# Altium project HA_MSS200529.PrjPcb
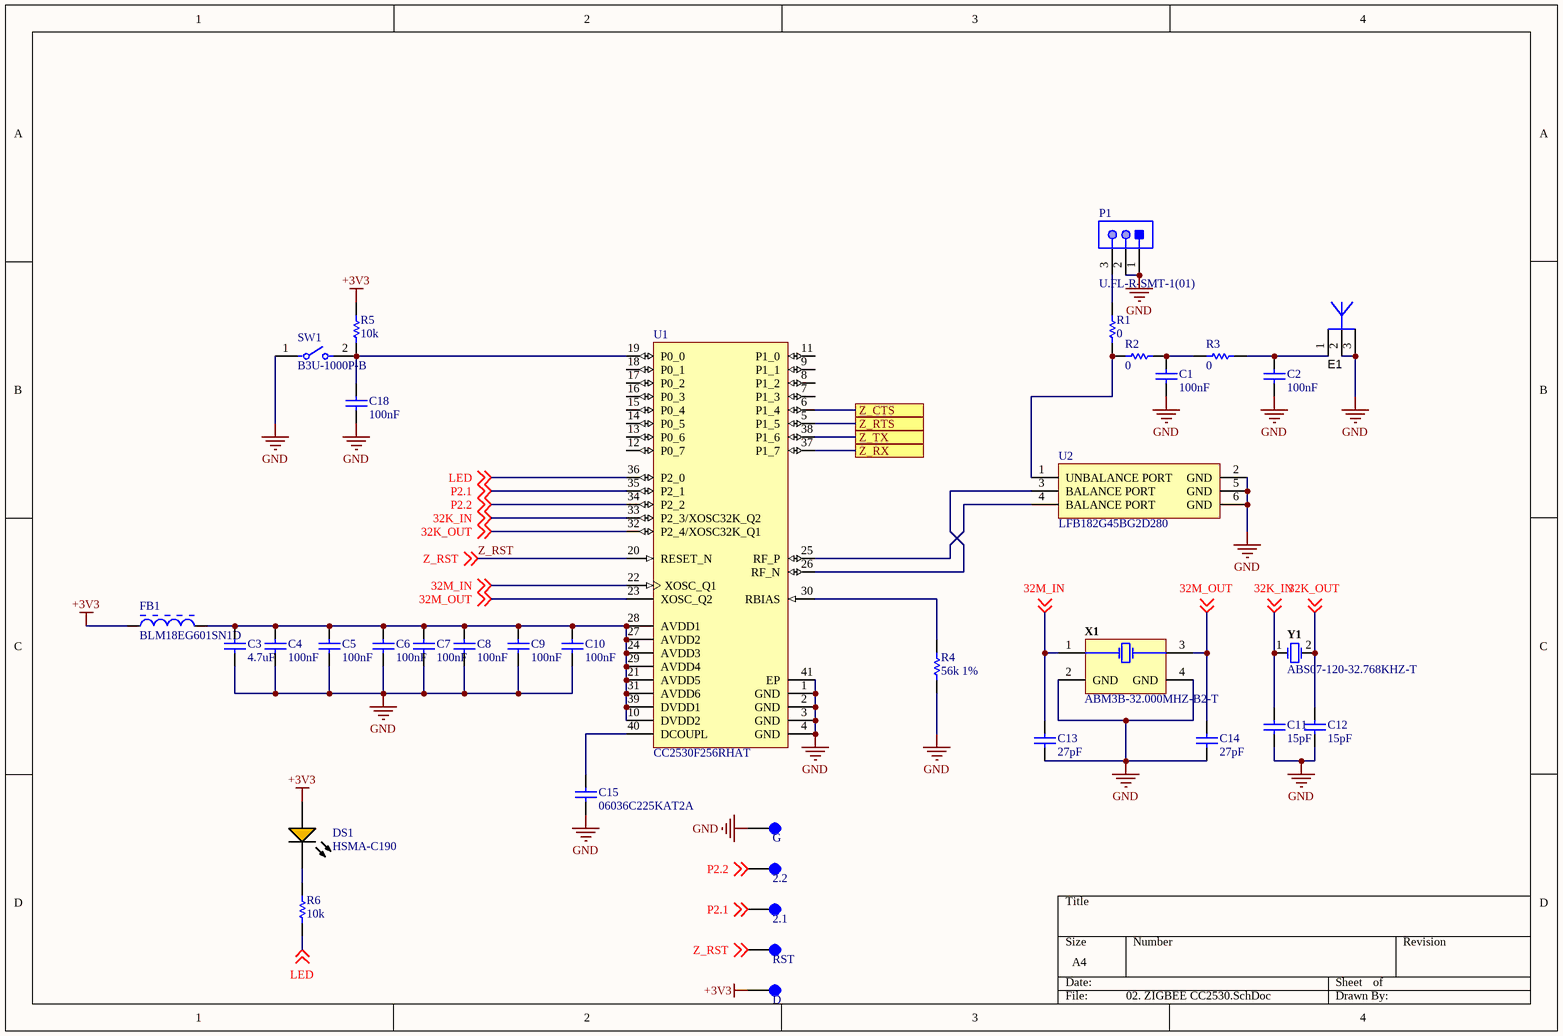
[diagram p0: 02. ZIGBEE CC2530.SchDoc]
4 sheets, 81 parts. Net scope: flat (ports and power ports of the same name join across sheets).
Board file: HA_MSS200529PCB.PcbDoc
Sheets:
  01. MAIN.SchDoc
  02. ZIGBEE CC2530.SchDoc
  03. MCU.SchDoc
  04. SENSOR SHT30, PIR, TSL2561.SchDoc

## Sheet 01. MAIN.SchDoc
size A4

### Notes on the sheet
- Title
- Size:
- Date:
- A4
- Number:
- Time:
- Revision:
- Sheet
- of
- N.S.T
- Design by:
- Check by:
- https://github.com/tung080827

## Sheet 02. ZIGBEE CC2530.SchDoc
size A4

### Parts
2.1  Test Point  [TP]  (value not drawn)
2.2  Test Point  [TP]  (value not drawn)
C1  100nF  [CAPC1005X56X25NL10T15]
C2  100nF  [CAPC1005X56X25NL10T15]
C3  4.7uF  [CAPC1608X90X35NL10T15]
C4  100nF  [CAPC1005X56X25NL10T15]
C5  100nF  [CAPC1005X56X25NL10T15]
C6  100nF  [CAPC1005X56X25NL10T15]
C7  100nF  [CAPC1005X56X25NL10T15]
C8  100nF  [CAPC1005X56X25NL10T15]
C9  100nF  [CAPC1005X56X25NL10T15]
C10  100nF  [CAPC1005X56X25NL10T15]
C11  15pF  [CAPC1005X56X25NL10T15]
C12  15pF  [CAPC1005X56X25NL10T15]
C13  27pF  [CAPC1005X56X25NL10T15]
C14  27pF  [CAPC1005X56X25NL10T15]
C15  06036C225KAT2A  [CAPC1608X90X35NL15T15]
C18  100nF  [CAPC1005X56X25NL10T15]
D  Test Point  [TP]  (value not drawn)
DS1  HSMA-C190  [AVAG-HSMX-C190_V]
E1  ANTENNA_DN007A  [2.4Ghz TI ANTENNA_DN007A]  (value not drawn)  (net tie)
FB1  BLM18EG601SN1D  [MURA-BLM18-F-H1-CHIP-2_V]
G  Test Point  [TP]  (value not drawn)
P1  U.FL-R-SMT-1(01)  [HRS-U.FL-R-SMT-3_V]
R1  0  [RESC1005X40X25NL05T05]
R2  0  [RESC1005X40X25NL05T05]
R3  0  [RESC1005X40X25NL05T05]
R4  56k 1%  [RESC1609X50X30NL10T20]
R5  10k  [RESC1005X40X25NL05T05]
R6  10k  [RESC1005X40X25NL05T05]
RST  Test Point  [TP]  (value not drawn)
SW1  B3U-1000P-B  [FP-B3U-1000P-B-MFG]
U1  CC2530F256RHAT  [RHA0040H_V]
U2  LFB182G45BG2D280  [MURA-LFB182G45BG5D920-6_V]
X1  ABM3B-32.000MHZ-B2-T  [ABRA-ABM3B_V]
Y1  ABS07-120-32.768KHZ-T  [ABRA-ABS07_A_V]

### Ports
Z_CTS, Z_RTS, Z_RX, Z_TX

### Nets
+3V3: D.1 DS1.1(A) FB1.1 R5.2
GND: C1.1 C2.1 C3.1 C4.1 C5.1 C6.1 C7.1 C8.1 C9.1 C10.1 C11.2 C12.2 C13.1 C14.1 C15.1 C18.1 E1.2 E1.3 G.1 P1.1 P1.2 R4.1 SW1.1 U1.1(GND) U1.2(GND) U1.3(GND) U1.4(GND) U1.41(EP) U2.2(GND) U2.5(GND) U2.6(GND) X1.2(GND) X1.4(GND)
32K_IN: C11.1 U1.33(P2_3/XOSC32K_Q2) Y1.1 ; off-sheet 32K_IN
32K_OUT: C12.1 U1.32(P2_4/XOSC32K_Q1) Y1.2 ; off-sheet 32K_OUT
32M_IN: C13.2 U1.22(XOSC_Q1) X1.1(X1) ; off-sheet 32M_IN
32M_OUT: C14.2 U1.23(XOSC_Q2) X1.3(X2) ; off-sheet 32M_OUT
LED: R6.1 U1.36(P2_0) ; off-sheet LED
P2.1: 2.1.1 U1.35(P2_1) ; off-sheet P2.1
P2.2: 2.2.1 U1.34(P2_2) ; off-sheet P2.2
Z_RST: RST.1 U1.20(RESET_N) ; off-sheet Z_RST
NetC1_2: C1.2 R2.1 R3.2
NetC2_2: C2.2 E1.1 R3.1
NetC3_2: C3.2 C4.2 C5.2 C6.2 C7.2 C8.2 C9.2 C10.2 FB1.2 U1.10(DVDD2) U1.21(AVDD5) U1.24(AVDD3) U1.27(AVDD2) U1.28(AVDD1) U1.29(AVDD4) U1.31(AVDD6) U1.39(DVDD1)
NetC15_2: C15.2 U1.40(DCOUPL)
NetC18_2: C18.2 R5.1 SW1.2 U1.19(P0_0)
NetDS1_2: DS1.2(K) R6.2
NetP1_3: P1.3 R1.1
NetR1_2: R1.2 R2.2 U2.1(UNBALANCE_PORT)
NetR4_2: R4.2 U1.30(RBIAS)
NetU1_5: U1.5(P1_5) ; port Z_RTS
NetU1_6: U1.6(P1_4) ; port Z_CTS
NetU1_25: U1.25(RF_P) U2.4(BALANCE_PORT)
NetU1_26: U1.26(RF_N) U2.3(BALANCE_PORT)
NetU1_37: U1.37(P1_7) ; port Z_RX
NetU1_38: U1.38(P1_6) ; port Z_TX

Not connected (* = marked no-connect by the designer): U1 7(P1_3) 8(P1_2) 9(P1_1) 11(P1_0) 12(P0_7) 13(P0_6) 14(P0_5) 15(P0_4) 16(P0_3) 17(P0_2) 18(P0_1)

### Library data of the parts
2.1 2.2 D G RST = TP
C1 C2 C4-C10 C18 = CMP-2008-02743-1: Manufacturer: AVX Interconnect / Elco; Part Number: 04026D104KAT2A
C3 = CMP-2006-02545-1: Part Number: GRM188R6YA475KE15D; Manufacturer: Murata
C11-C14 = CMP-2008-02620-1: Part Number: 04025A270FAT2A; Manufacturer: AVX Interconnect / Elco
C15 = CMP-2006-04473-1: Manufacturer: AVX Interconnect / Elco; Part Number: 06036C225KAT2A
DS1 = CMP-1744-00005-1: LED Uni-Color Amber, 60 mW, 20 mA, -40 to 85 degC, 2-Pin SMD, RoHS, Tape and Reel; Resistance: 70000 Ohm; ESR: 70 kohm; Frequency: 32.768 KHz; Tolerance: 20ppm; Load Capacitance: 12.5 pF; Capacitance: 1.25E-11 f; Length: 0.126 inch; ComponentLink1Description: Manufacturer URL; Min Operating Temperature: -40degC; RoHSCompliant: True; ComponentLink1URL: http://www.avagotech.com/; Packaging: Tape and Reel; PackageDescription: 2-Pin Surface Mount Device, Body 1.6 x 0.8 mm, Height 0.9 mm; ComponentLink3Description: Package Specification; Width: 0.059 inch; Mount: Surface Mount; REACH SVHC: No SVHC; ComponentLink2URL: http://docs.avagotech.com/docs/AV02-0112EN; Height: 0.033 inch; ComponentLink2Description: Datasheet; Pins: 2; Frequency Tolerance: 20ppm; Max Operating Temperature: 85degC; ComponentLink3URL: http://www.fairchildsemi.com/dwg/MA/MA03D.pdf; PackageReference: HSMX-C190; Package Quantity: 1; DatasheetVersion: Sep-10
E1 = ANTENNA_DN007A: 2.4GHz PCB Antenna.  There is nothing to buy or mount.; SymbolCreator: a0412235; SymbolVersion: 2014-08-14; PartNumber: ANTENNA_DN007A; Manufacturer: N/A; CompType: Antenna; MountType: N/A; ComponentLink1Description: Datasheet Link; ComponentLink1URL: https://sps06.itg.ti.com/sites/KMS/crossdivteams/altium/docs/ComponentDatasheets/CC26xxEM-7IB_1_0_Layout.pdf; PackageReference: SMD, 3-Leads; Publisher: Texas Instruments; LatestRevisionDate: 2015-12-09
FB1 = CMP-0686-00354-2: Chip Ferrite Bead for GHz Band General Use (Low DC Resistance Type), 600 Ohm, 500 mA, -55 to 125 degC, 1.6 x 0.8 x 0.95 mm SMD, Tape and Reel; Manufacturer: Murata; Rated Current: 500 mA; DC Resistance: 0.35 Ohm Max.; Impedance (at 100 MHz): 600 Ohm +/- 25%; Packing: Tape and Reel; ComponentLink2URL: http://www.murata.com/products/catalog/pdf/c31e.pdf; PartNumber: BLM18EG601SN1D; Mounting Technology: Surface Mount; Operating Temperature Range: -55 to 125 degC; ComponentLink3URL: http://www.murata.com/products/catalog/pdf/c31e.pdf; ComponentLink2Description: Datasheet; ComponentLink1Description: Manufacturer URL; DatasheetVersion: 08/2013; ComponentLink1URL: http://www.murata.com/; PackageReference: BLM18_H950-2; ComponentLink3Description: Package Specification; PackageDescription: 2-Pin Chip, Body 1.6 x 0.8 mm
P1 = CMP-2000-05153-1: Ultra Small Coaxial Connector, 6 GHz, -40 to 90 degC, 3-Pin SMD, RoHS, Bulk; Manufacturer: Hirose Electric; Connector Style: U.FL; Impedance: 50Ohm; Dielectric Material: LiquidCrystalPolymer(LCP); Minimum Quantity: UltraMiniatureCoaxial; Online Catalog: U.FLSeries; Featured Product: HiroseU.FLSeries; Frequency - Max: 6GHz; Other Names: H122041 / U.FL-R-SMT-1(01)-ND; Contact Termination: Solder; Body Material: PhosphorBronze; Connector Type: Jack,MalePin; Body Finish: Silver; Center Contact Plating: Gold; Manufacturer URL: https://www.hirose.com; Family: CoaxialConnectors(RF); Fastening Type: Snap-On; Unit PriceUSD: U.FL; Series: U.FL; Package Reference: U.FL-R-SMT; Packaging: Bulk; Standard Package: 100; Mounting Type: SurfaceMount; Quantity Available: Bulk; Housing Color: Silver; Package Description: 3-Pin Surface Mount Device, Body 2.6 x 2.6 mm; Category: Connectors,Interconnects; Operating Temperature: -40degC~90degC; Center Contact Material: PhosphorBronze; Dynamic Catalog: U.FLSeries; Datasheet URL: https://datasheet.ciiva.com/26945/getdatasheetpartid-475239-26945414.pdf; Datasheet Version: Feb-09; Shield Termination: Solder
R1-R3 R5 R6 = CMP-2000-07588-1: Chip Resistor, 10 KOhm, +/- 1%, 0.1 W, -55 to 155 degC, 0402 (1005 Metric), RoHS, Tape and Reel; Manufacturer: Panasonic; Power Rating: 100mW; Voltage Rating: 50V; Resistance: 10KOhm; Case\/Package: 0402; Temperature Coefficient: 100ppm\/degreesC; RoHSCompliant: True; Lead Free: LeadFree; Package Quantity: 1; Contact Plating: Tin; Length: 1mm; Radiation Hardening: No; REACH SVHC: NoSVHC; Max Operating Temperature: 155degC; Depth: 0.5mm; Case Code (Imperial): 0402; Military Standard: Not; Package Description: 2-Pin Surface Mount Device, Body 1 x 0.5 mm; Termination: SMD/SMT; Case Code (Metric): 1005; Height: 0.35mm; Packaging: TapeandReel; Voltage Rating (DC): 50V; Package Reference: 402; Number of Pins: 2; Tolerance: 1%; Mounting Technology: SurfaceMount; Width: 0.02inch; Mount: SurfaceMount; Datasheet URL: https://industrial.panasonic.com/cdbs/www-data/pdf/RDA0000/AOA0000C304.pdf; Composition: ThickFilm; Datasheet Version: 02/2017; Manufacturer URL: http://www.panasonic.com/; Max Power Dissipation: 100mW; Number of Terminations: 2; Min Operating Temperature: -55degC
R4 = CMP-2000-03467-1: Part Number: CRCW060356K0FKEA; Manufacturer: Vishay Dale
SW1 = CMP-08834-000005-1: SWITCH TACTILE SPST-NO 0.05A 12V; Manufacturer: Omron; Operating Force: 1.5N; Contact Current Rating: 50mA; Contact Resistance: 100mΩ; Electromechanical Life: 200000Cycles; Height: 1.75mm; Device Class L2: Switches; Temperature Range High: +70°C; Digikey Description: SWITCH TACTILE SPST-NO 0.05A 12V; Throw Configuration: SPST-NO; Ambient Temperature Range High: +70°C; Temperature: -25°C to +70°C; Lead Free: Yes; ComponentLink2URL: https://omronfs.omron.com/en_US/ecb/products/pdf/en-b3u.pdf; Device Class L3: Tactile Switches; Manufacturer Part Number: B3U-1000P-B; Ambient Temperature Range Low: -25°C; Mount: Surface Mount; Automotive: No; Mouser Description: Tactile Switches Top Actuated with boss w/o ground; Octopart: https://octopart.com/b3u-1000p-b-omron-1057356; RoHS: TRUE; Package: 0; Device Class L1: Electromechanical; Voltage Rating Dc: 12V; Category: Switch; Temperature Range Low: -25°C; ComponentLink2Description: Datasheet
U1 = CMP-0458-00002-3: CC2530 System-on-Chip Solution for 2.4-GHz IEEE 802.15.4 and ZigBee Applications; Manufacturer: Texas Instruments; Frequency Range: 2.4GHz; Data Rate (Max) (kbps): 250; Pin/Package: 40VQFN; Modulation Techniques: DSSS; Standby Current (uA): 0.4; Antenna Connection: Differential; Flash size (KB): 256; Operating Voltage (Min) (V): 2; RAM Size (KB): 8; Sensitivity (Best) (dBm): -97; RX Current (Lowest) (mA): 20.5; TX Power (dBm): 4.5; Operating Voltage (Max) (V): 3.6; Wakeup Time (PD-->RX/TX) (us): 600; ComponentLink3URL: http://www.ti.com/lit/ml/mpqf135c/mpqf135c.pdf; ComponentLink1URL: http://www.ti.com/; Device Type: System-on-Chip; ComponentLink2URL: http://www.ti.com/lit/ds/symlink/cc2530.pdf; ComponentLink2Description: Datasheet; ComponentLink1Description: Manufacturer URL; Mounting Technology: Surface Mount; PartNumber: CC2530F256RHAT; DatasheetVersion: SWRS081B; ComponentLink3Description: Package Specification; PackageVersion: 4204276/E; PackageDescription: 40-Pin Quad Flat No-Lead Package, Body 6 x 6mm, Pitch 0.5mm; PackageReference: RHA0040H
U2 = CMP-2000-06539-1: Balance Matching Band Pass Filter, -40 to 85 degC, 6-Pin SMD, RoHS, Tape and Reel; Manufacturer: Murata; Insertion Loss: 0.75dB; Bandwidth: 2.45GHz; Frequency Range: 2.4GHzto2.5GHz; Impedance: 50Ohms; Brand: MurataElectronics; Frequency: 2.4GHz; Product: BandPassFilters; Mounting Technology: SurfaceMount; Product Category: SignalConditioning; RoHS: Details; Packaging: Reel; Operating Temperature Range: -40Cto+85C; Series: LFB; Package Reference: LFB182G45BG2D280; Datasheet Version: 01/2016; Package / Case: 0603(1608metric); Manufacturer URL: http://www.murata.com/; PartNumber: LFB182G45BG2D280; Datasheet URL: http://www.murata.com/~/media/webrenewal/products/balun/balun/forconnectivity/lfb182g45bg2d280.ashx?la=en; Factory Pack Quantity: 4000; Package Description: 6-Pin Chip Array, Body 1.6 x 0.8 mm, Pitch 0.5 mm; Type: BandPassFilter; Termination Style: SMD/SMT
X1 = CMP-1688-00002-1: Ceramic SMD Crystal, 8 MHz, +/- 20 ppm, 200 Ohm, -20 to 70 degC, 4-Pin SMD, RoHS, Tape and Reel; Max Supply Voltage: 45 V; Outputs: 4; Min Supply Voltage: 8.2 V; Output Voltage: 3.3 V; Switching Frequency: 30 KHz; Output Current: 1.8 A; Packaging: Rail/Tube; ComponentLink2Description: Datasheet; REACH SVHC: No SVHC; ComponentLink1URL: http://www.abracon.com/; PackageReference: ABM3B; Weight: 0.004233 oz; Height: 1.05 mm; ComponentLink2URL: http://www.abracon.com/Resonators/abm3b.pdf; Mount: Surface Mount; Min Operating Temperature: -40 degC; Max Operating Temperature: 85 degC; Package Quantity: 50; PackageDescription: 4-Pin Surface Mount Device, Body 5 x 3.2 mm; Pins: 28; DatasheetVersion: Aug-15; ComponentLink1Description: Manufacturer URL; RoHSCompliant: true; Radiation Hardening: No; Length: 9.8 mm; Width: 4.5 mm
Y1 = CMP-2000-07587-1: Tuning Fork Crystal, 32.768 KHz, +/- 20 ppm, -40 to 85 degC, 2-Pin SMD, RoHS, Tape and Reel; Manufacturer: Abracon; Case\/Package: SMD/SMT; Series Resistance: 60KOhm; Frequency Tolerance: 20ppm; Load Capacitance: 6pF; ESR (Equivalent Series Resistance): 55KOhm; Max Operating Temperature: 85degC; Width: 0.061inch; Radiation Hardening: No; Lead Free: LeadFree; RoHSCompliant: True; Depth: 1.5mm; Datasheet URL: http://www.abracon.com/Resonators/ABS07-120-32.768kHz-T.pdf; Frequency: 32.768KHz; Termination: SMD/SMT; Manufacturer URL: http://www.abracon.com/; Package Quantity: 3000; Packaging: TapeandReel; Number of Pins: 2; Height: 0.035inch; Package Description: 2-Pin Surface Mount Device, Body 3.2 x 1.5 mm; Package Reference: ABS07; Mount: SurfaceMount; Tolerance: 20ppm; Mounting Technology: SurfaceMount; REACH SVHC: NoSVHC; Datasheet Version: 11/2014; Length: 3.2mm; Min Operating Temperature: -40degC

## Sheet 03. MCU.SchDoc
size A4
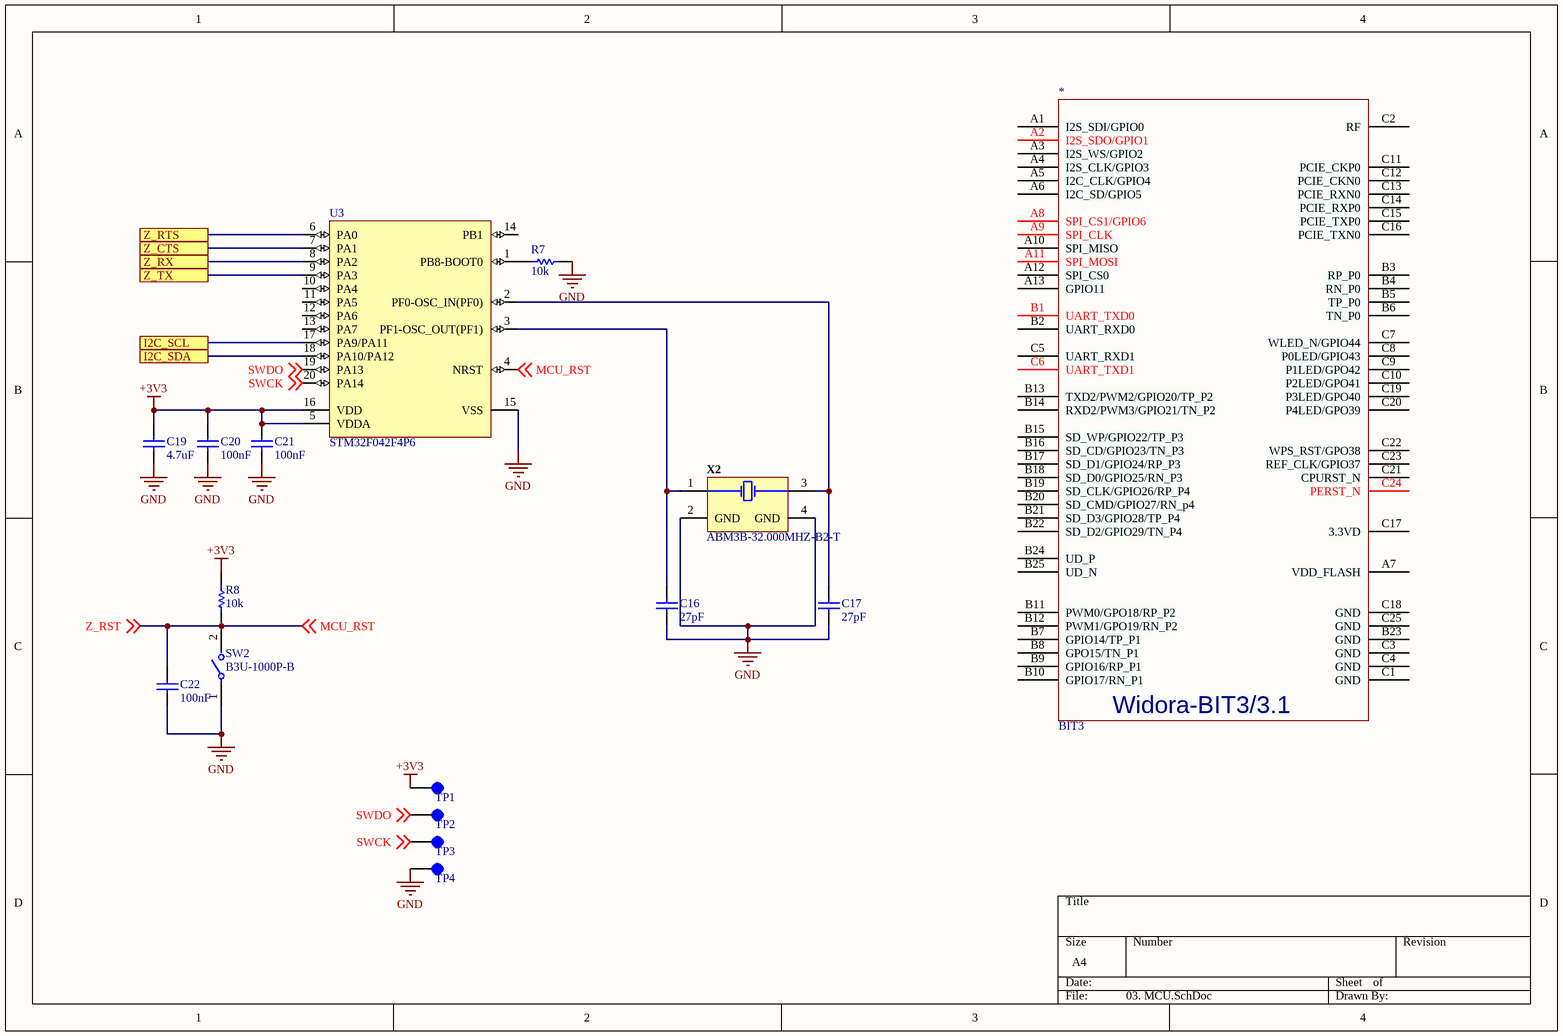
[diagram p1: 03. MCU.SchDoc]

### Parts
*  BIT3  [Widora-BIT3]
C16  27pF  [CAPC1005X56X25NL10T15]
C17  27pF  [CAPC1005X56X25NL10T15]
C19  4.7uF  [CAPC1608X90X35NL10T15]
C20  100nF  [CAPC1005X56X25NL10T15]
C21  100nF  [CAPC1005X56X25NL10T15]
C22  100nF  [CAPC1005X56X25NL10T15]
R7  10k  [RESC1005X40X25NL05T05]
R8  10k  [RESC1005X40X25NL05T05]
SW2  B3U-1000P-B  [FP-B3U-1000P-B-MFG]
TP1  Test Point  [TP]  (value not drawn)
TP2  Test Point  [TP]  (value not drawn)
TP3  Test Point  [TP]  (value not drawn)
TP4  Test Point  [TP]  (value not drawn)
U3  STM32F042F4P6  [STM-TSSOP20_M]
X2  ABM3B-32.000MHZ-B2-T  [ABRA-ABM3B_V]

### Ports
I2C_SCL, I2C_SDA, Z_CTS, Z_RTS, Z_RX, Z_TX

### Nets
+3V3: C19.2 C20.2 C21.2 R8.1 TP1.1 U3.5(VDDA) U3.16(VDD)
GND: C16.1 C17.1 C19.1 C20.1 C21.1 C22.1 R7.1 SW2.1 TP4.1 U3.15(VSS) X2.2(GND) X2.4(GND)
SWCK: TP3.1 U3.20(PA14) ; off-sheet SWCK
SWDO: TP2.1 U3.19(PA13) ; off-sheet SWDO
Z_RST: C22.2 R8.2 SW2.2 U3.4(NRST) ; off-sheet MCU_RST, off-sheet Z_RST  [also labelled MCU_RST]
NetC16_2: C16.2 U3.3(PF1-OSC_OUT(PF1)) X2.1(X1)
NetC17_2: C17.2 U3.2(PF0-OSC_IN(PF0)) X2.3(X2)
NetR7_2: R7.2 U3.1(PB8-BOOT0)
NetR9_1: U3.18(PA10/PA12) ; port I2C_SDA
NetR10_1: U3.17(PA9/PA11) ; port I2C_SCL
NetU1_5: U3.6(PA0) ; port Z_RTS
NetU1_6: U3.7(PA1) ; port Z_CTS
NetU1_37: U3.8(PA2) ; port Z_RX
NetU1_38: U3.9(PA3) ; port Z_TX

Not connected (* = marked no-connect by the designer): * A1(I2S_SDI/GPIO0) A2(I2S_SDO/GPIO1) A3(I2S_WS/GPIO2) A4(I2S_CLK/GPIO3) A5(I2C_CLK/GPIO4) A6(I2C_SD/GPIO5) A7(VDD_FLASH) A8(SPI_CS1/GPIO6) A9(SPI_CLK) A10(SPI_MISO) A11(SPI_MOSI) A12(SPI_CS0) A13(GPIO11) B1(UART_TXD0) B2(UART_RXD0) B3(RP_P0) B4(RN_P0) B5(TP_P0) B6(TN_P0) B7(GPIO14/TP_P1) B8(GPO15/TN_P1) B9(GPIO16/RP_P1) B10(GPIO17/RN_P1) B11(PWM0/GPO18/RP_P2) B12(PWM1/GPO19/RN_P2) B13(TXD2/PWM2/GPIO20/TP_P2) B14(RXD2/PWM3/GPIO21/TN_P2) B15(SD_WP/GPIO22/TP_P3) B16(SD_CD/GPIO23/TN_P3) B17(SD_D1/GPIO24/RP_P3) B18(SD_D0/GPIO25/RN_P3) B19(SD_CLK/GPIO26/RP_P4) B20(SD_CMD/GPIO27/RN_p4) B21(SD_D3/GPIO28/TP_P4) B22(SD_D2/GPIO29/TN_P4) B23(GND) B24(UD_P) B25(UD_N) C1(GND) C2(RF) C3(GND) C4(GND) C5(UART_RXD1) C6(UART_TXD1) C7(WLED_N/GPIO44) C8(P0LED/GPIO43) C9(P1LED/GPO42) C10(P2LED/GPO41) C11(PCIE_CKP0) C12(PCIE_CKN0) C13(PCIE_RXN0) C14(PCIE_RXP0) C15(PCIE_TXP0) C16(PCIE_TXN0) C17(3.3VD) C18(GND) C19(P3LED/GPO40) C20(P4LED/GPO39) C21(CPURST_N) C22(WPS_RST/GPO38) C23(REF_CLK/GPIO37) C24(PERST_N) C25(GND); U3 10(PA4) 11(PA5) 12(PA6) 13(PA7) 14(PB1)

### Notes on the sheet
- (in symbol BIT3) Widora-BIT3/3.1

### Library data of the parts
C16 C17 = CMP-2008-02620-1: as C11 on sheet 02. ZIGBEE CC2530
C19 = CMP-2006-02545-1: as C3 on sheet 02. ZIGBEE CC2530
C20-C22 = CMP-2008-02743-1: as C1 on sheet 02. ZIGBEE CC2530
R7 R8 = CMP-2000-07588-1: as R1 on sheet 02. ZIGBEE CC2530; RoHSCompliant: True; Lead Free: LeadFree; Package Quantity: 1; Contact Plating: Tin; Length: 1mm; Radiation Hardening: No; REACH SVHC: NoSVHC; Max Operating Temperature: 155degC; Depth: 0.5mm; Case Code (Imperial): 0402; Military Standard: Not; Package Description: 2-Pin Surface Mount Device, Body 1 x 0.5 mm; Termination: SMD/SMT; Case Code (Metric): 1005; Height: 0.35mm; Packaging: TapeandReel; Voltage Rating (DC): 50V; Package Reference: 402; Number of Pins: 2; Tolerance: 1%; Mounting Technology: SurfaceMount; Width: 0.02inch; Mount: SurfaceMount; Datasheet URL: https://industrial.panasonic.com/cdbs/www-data/pdf/RDA0000/AOA0000C304.pdf; Composition: ThickFilm; Datasheet Version: 02/2017; Manufacturer URL: http://www.panasonic.com/; Max Power Dissipation: 100mW; Number of Terminations: 2; Min Operating Temperature: -55degC
SW2 = CMP-08834-000005-1: as SW1 on sheet 02. ZIGBEE CC2530; Height: 1.75mm; Device Class L2: Switches; Temperature Range High: +70°C; Digikey Description: SWITCH TACTILE SPST-NO 0.05A 12V; Throw Configuration: SPST-NO; Ambient Temperature Range High: +70°C; Temperature: -25°C to +70°C; Lead Free: Yes; ComponentLink2URL: https://omronfs.omron.com/en_US/ecb/products/pdf/en-b3u.pdf; Device Class L3: Tactile Switches; Manufacturer Part Number: B3U-1000P-B; Ambient Temperature Range Low: -25°C; Mount: Surface Mount; Automotive: No; Mouser Description: Tactile Switches Top Actuated with boss w/o ground; Octopart: https://octopart.com/b3u-1000p-b-omron-1057356; RoHS: TRUE; Package: 0; Device Class L1: Electromechanical; Voltage Rating Dc: 12V; Category: Switch; Temperature Range Low: -25°C; ComponentLink2Description: Datasheet
TP1-TP4 = TP
U3 = CMP-0304-00106-2: ARM Cortex-M0 32-bit MCU, 16 KB Flash, 6 KB Internal RAM, 16 I/Os, 20-Pin TSSOP, -40 to 85 degC, Tray; Manufacturer: STMicroelectronics; Supply Voltage(Vcc) min (V): 2; Operating Frequency(F) (Processor speed) (MHz): 48; Internal RAM Size (kB): 6; FLASH Size (Prog) (kB): 16; PartNumber: STM32F042F4P6; DatasheetVersion: Rev. 5; Package Reference: TSSOP20; Packing: Tray; ComponentLink2URL: http://www.st.com/st-web-ui/static/active/en/resource/technical/document/datasheet/DM00105814.pdf; Core: ARM Cortex-M0; ComponentLink2Description: Datasheet; ComponentLink1URL: http://www.st.com/; Package Description: 20-Pin Thin Shrink Small Outline Package, Body 6.5 x 4.4 mm, Pitch 0.65 mm; Mounting Technology: Surface Mount; ComponentLink1Description: Manufacturer URL; I/Os (High Current): 16
X2 = CMP-1688-00002-1: as X1 on sheet 02. ZIGBEE CC2530; Packaging: Rail/Tube; ComponentLink2Description: Datasheet; REACH SVHC: No SVHC; ComponentLink1URL: http://www.abracon.com/; PackageReference: ABM3B; Weight: 0.004233 oz; Height: 1.05 mm; ComponentLink2URL: http://www.abracon.com/Resonators/abm3b.pdf; Mount: Surface Mount; Min Operating Temperature: -40 degC; Max Operating Temperature: 85 degC; Package Quantity: 50; PackageDescription: 4-Pin Surface Mount Device, Body 5 x 3.2 mm; Pins: 28; DatasheetVersion: Aug-15; ComponentLink1Description: Manufacturer URL; RoHSCompliant: true; Radiation Hardening: No; Length: 9.8 mm; Width: 4.5 mm

## Sheet 04. SENSOR SHT30, PIR, TSL2561.SchDoc
size A3
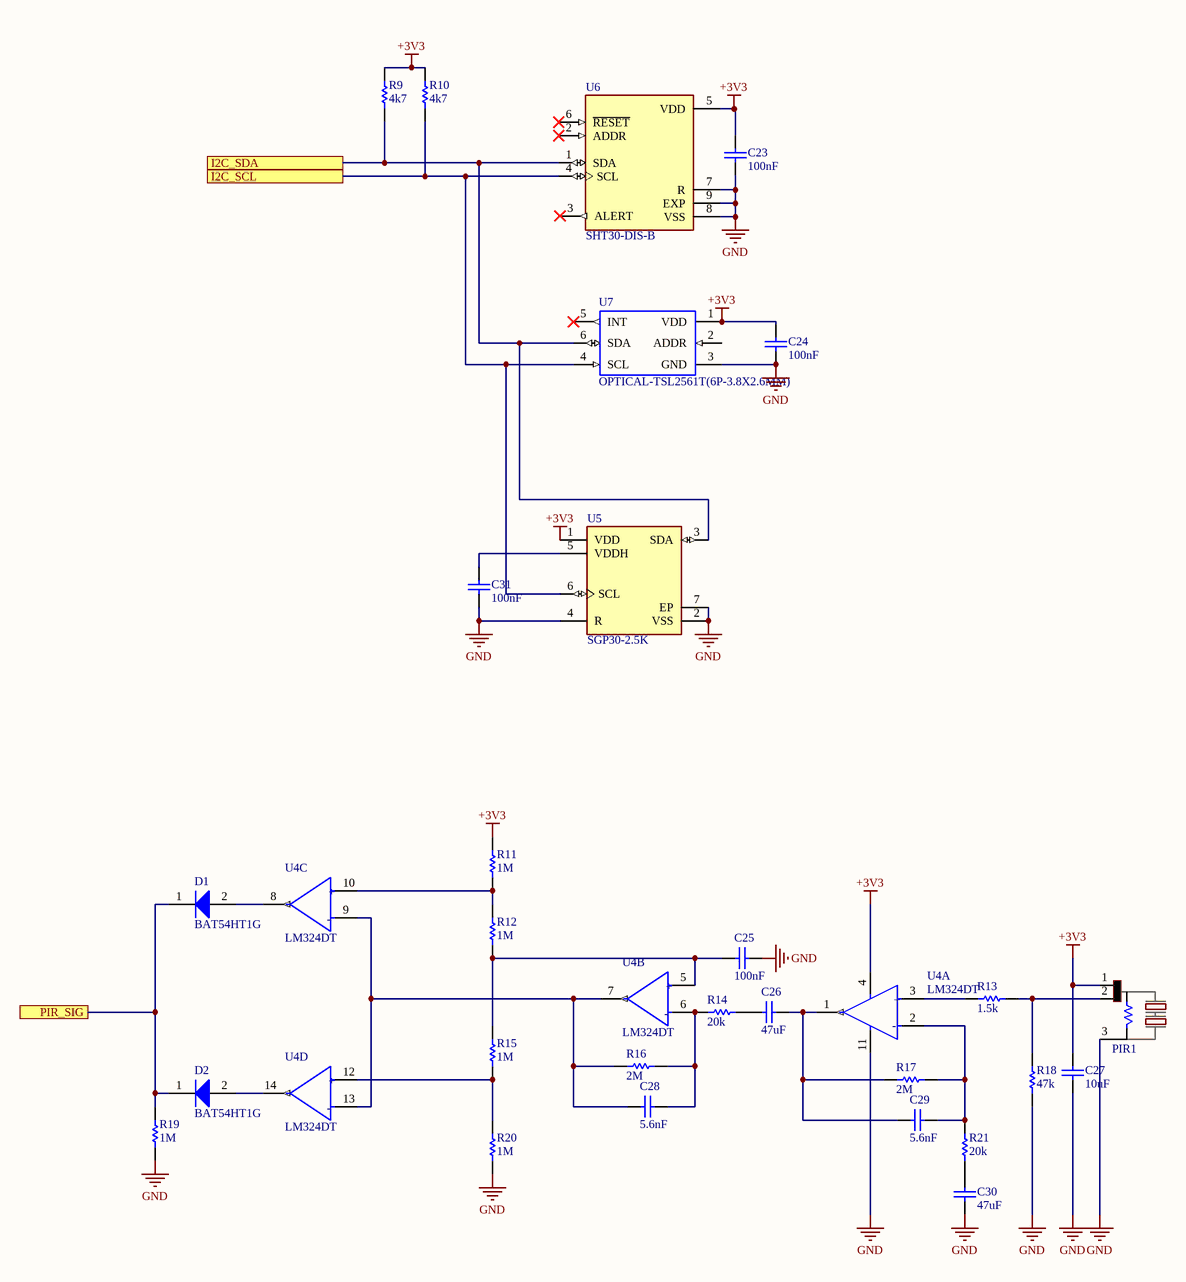
[diagram p2: 04. SENSOR SHT30, PIR, TSL2561.SchDoc]

### Parts
C23  100nF  [CAPC1005X56X25NL10T15]
C24  100nF  [CAPC1005X56X25NL10T15]
C25  100nF  [CAPC1005X56X25NL10T15]
C26  47uF  [CAPC1608X90X35NL10T15]
C27  10uF  [CAPC1608X90X35NL10T15]
C28  5.6nF  [CAPC1005X56X25NL10T15]
C29  5.6nF  [CAPC1005X56X25NL10T15]
C30  47uF  [CAPC1608X90X35NL10T15]
C31  100nF  [CAPC1005X56X25NL10T15]
D1  BAT54HT1G  [ONSC-SOD-323-2-477-02_V]
D2  BAT54HT1G  [ONSC-SOD-323-2-477-02_V]
PIR1  D203S  [D203B PIR]  (value not drawn)
R9  4k7  [RESC1005X40X25NL05T05]
R10  4k7  [RESC1005X40X25NL05T05]
R11  1M  [RESC1005X40X25NL05T05]
R12  1M  [RESC1005X40X25NL05T05]
R13  1.5k  [RESC1005X40X25NL05T05]
R14  20k  [RESC1005X40X25NL05T05]
R15  1M  [RESC1005X40X25NL05T05]
R16  2M  [RESC1005X40X25NL05T05]
R17  2M  [RESC1005X40X25NL05T05]
R18  47k  [RESC1005X40X25NL05T05]
R19  1M  [RESC1005X40X25NL05T05]
R20  1M  [RESC1005X40X25NL05T05]
R21  20k  [RESC1005X40X25NL05T05]
U4  LM324DT  [FP-SO-14-MFG]  (parts A,B,C,D of 4)
U5  SGP30-2.5K  [FP-SGP30-2_5K-MFG]
U6  SHT30-DIS-B  [DFN250X250X100-9N]
U7  OPTICAL-TSL2561T(6P-3.8X2.6MM)  [TMB6-1.55-3.8X2.6MM]

### Ports
I2C_SCL, I2C_SDA, PIR_SIG

### Nets
+3V3: C23.2 C24.2 C27.1 PIR1.1(VDD) R9.2 R10.2 R11.2 U4.4(VCC+) U5.1(VDD) U6.5(VDD) U7.1(VDD)
GND: C23.1 C24.1 C25.2 C27.2 C30.1 C31.1 PIR1.3(VDD) R18.2 R19.1 R20.1 U4.11(VCC-) U5.2(VSS) U5.4(R) U5.7(EP) U6.7(R) U6.8(VSS) U6.9(EXP) U7.3(GND)
NetC25_1: C25.1 R12.1 R15.2 U4.5(Non-Inverting_Input_2)
NetC26_1: C26.1 R14.1
NetC26_2: C26.2 C29.1 R17.2 U4.1(Output_1)
NetC28_1: C28.1 R16.2 U4.7(Output_2) U4.9(Inverting_Input_3) U4.13(Inverting_Input_4)
NetC28_2: C28.2 R14.2 R16.1 U4.6(Inverting_Input_2)
NetC29_2: C29.2 R17.1 R21.1 U4.2(Inverting_Input_1)
NetC30_2: C30.2 R21.2
NetC31_2: C31.2 U5.5(VDDH)
NetD1_1: D1.1(K) D2.1(K) R19.2 ; port PIR_SIG
NetD1_2: D1.2(A) U4.8(Output_3)
NetD2_2: D2.2(A) U4.14(Output_4)
NetPIR1_2: PIR1.2(G) R13.2 R18.1
NetR9_1: R9.1 U5.3(SDA) U6.1(SDA) U7.6(SDA) ; port I2C_SDA
NetR10_1: R10.1 U5.6(SCL) U6.4(SCL) U7.4(SCL) ; port I2C_SCL
NetR11_1: R11.1 R12.2 U4.10(Non-Inverting_Input_3)
NetR13_1: R13.1 U4.3(Non-Inverting_Input_1)
NetR15_1: R15.1 R20.2 U4.12(Non-Inverting_Input_4)

Not connected (* = marked no-connect by the designer): U6 2(ADDR)* 3(ALERT)* 6(~{RESET})*; U7 2(ADDR) 5(INT)*

### Notes on the sheet
- Title
- Size:
- Date:
- A4
- Number:
- Time:
- Revision:
- Sheet
- of
- N.S.T
- Design by:
- Check by:
- https://github.com/tung080827
- (in symbol CMP-12131-000005-1, part A) +; -
- (in symbol CMP-12131-000005-1, part B) +; -
- (in symbol CMP-12131-000005-1, part C) +; -
- (in symbol CMP-12131-000005-1, part D) +; -

### Library data of the parts
C23-C25 C28 C29 C31 = CMP-2008-02743-1: as C1 on sheet 02. ZIGBEE CC2530
C26 C27 C30 = CMP-2006-02792-1: Part Number: GRM188R60J106ME47D; Manufacturer: Murata
D1 D2 = CMP-1055-00462-1: Schottky Barrier Diode, 2-Pin SOD-323, Pb-Free, Tape and Reel; Manufacturer: On Semiconductor; Configuration: Single; trr Max (ns): 5; IFSM Max (A): 0.6; ComponentLink3URL: http://www.onsemi.com/pub_link/Collateral/477-02.PDF.1; PackageDescription: 2-Pin SOD, Body 1.7 x 1.25 mm; ComponentLink2URL: http://www.onsemi.cn/pub_link/Collateral/BAT54HT1-D.PDF; ComponentLink3Description: Package Specification; ComponentLink2Description: Datasheet; DatasheetVersion: Rev. 6; PackageReference: SOD-323-2-477-02; RoHS: TRUE; ComponentLink1URL: http://www.onsemi.com/; Packing: Tape and Reel; PartNumber: BAT54HT1G; Mounting Technology: Surface Mount; ComponentLink1Description: Manufacturer URL; PackageVersion: Rev. H, 03/2007
R9-R21 = CMP-2000-07588-1: as R1 on sheet 02. ZIGBEE CC2530; RoHSCompliant: True; Lead Free: LeadFree; Package Quantity: 1; Contact Plating: Tin; Length: 1mm; Radiation Hardening: No; REACH SVHC: NoSVHC; Max Operating Temperature: 155degC; Depth: 0.5mm; Case Code (Imperial): 0402; Military Standard: Not; Package Description: 2-Pin Surface Mount Device, Body 1 x 0.5 mm; Termination: SMD/SMT; Case Code (Metric): 1005; Height: 0.35mm; Packaging: TapeandReel; Voltage Rating (DC): 50V; Package Reference: 402; Number of Pins: 2; Tolerance: 1%; Mounting Technology: SurfaceMount; Width: 0.02inch; Mount: SurfaceMount; Datasheet URL: https://industrial.panasonic.com/cdbs/www-data/pdf/RDA0000/AOA0000C304.pdf; Composition: ThickFilm; Datasheet Version: 02/2017; Manufacturer URL: http://www.panasonic.com/; Max Power Dissipation: 100mW; Number of Terminations: 2; Min Operating Temperature: -55degC
U4 = CMP-12131-000005-1: IC OPAMP GP 4 CIRCUIT 14SO; Manufacturer: STMicroelectronics; Voltage Gain: 100dB; Standoff Height: 0.1mm; Bandwidth: 1.3MHz; Max Junction Temp: +150°C; Min Supply Voltage: 3V; Max Dual Supply Voltage: 15V; Min Dual Supply Voltage: 1.5V; Number Of Channels: 4; Nominal Supply Current: 0.7-1.5mA; Output Current Per Channel: 20-50mA; Max Supply Voltage: 30V; Input Offset Voltage: 2mV; Input Bias Current: 0.02uA; Device Class L1: Integrated Circuits (ICs); Device Class L3: Amplifiers - Op Amps; Temperature Range Low: 0°C; Package: SO-14; Temperature Range High: +70°C; Digikey Description: IC OPAMP GP 4 CIRCUIT 14SO; Device Class L2: Linear ICs; Footprint Url: https://www.st.com/content/ccc/resource/technical/document/datasheet/group3/10/8a/e6/12/f8/e8/49/ce/DM00366438/files/DM00366438.pdf/jcr:content/translations/en.DM00366438.pdf; Octopart: https://octopart.com/lm324dt-stmicroelectronics-39579146; ComponentLink2URL: https://www.st.com/content/ccc/resource/technical/document/datasheet/bd/fc/46/43/26/8f/40/7f/CD00001046.pdf/files/CD00001046.pdf/jcr:content/translations/en.CD00001046.pdf; ComponentLink2Description: Datasheet; Lead Free: Yes; Temperature: 0°C to +70°C; RoHS: TRUE; Gain Bandwidth: 1.3MHz; Manufacturer Part Number: LM324DT; Automotive: No; Category: IC; Height: 1.75mm; Mouser Description: LM324 Series 32 V 1.3 MHz Low Power Quad Operational Amplifier - SOIC-14
U5 = CMP-144026-000002-1: AIR QUALITY GAS SENSOR FOR VOC'S; Manufacturer: Sensirion; Min Supply Voltage: 1.62V; Sensor Output: I2C; Operating Supply Current: 48.8mA; Max Supply Voltage: 1.98V; Category: IC; Automotive: No; Device Class L3: unset; Device Class L1: Sensors; Device Class L2: unset; Temperature Range High: +85°C; Manufacturer Part Number: SGP30-2.5K; Octopart: https://octopart.com/sgp30-2.5k-sensirion-84561789; Height: 0.9mm; Temperature: -40°C to +85°C; Lead Free: Yes; Package: SGP30-2.5K; Temperature Range Low: -40°C; Digikey Description: AIR QUALITY GAS SENSOR FOR VOC'S; RoHS: TRUE; ComponentLink2Description: Datasheet; ComponentLink2URL: https://www.sensirion.com/fileadmin/user_upload/customers/sensirion/Dokumente/0_Datasheets/Gas/Sensirion_Gas_Sensors_SGP30_Datasheet.pdf
U6 = SHT30-DIS-B: Humidity Temperature Sensor 0 ~ 100% RH IÂ²C Â±3% RH 8s Surface Mount; MF: Sensirion AG; Package: DFN-8 Sensirion; Availability: Unavailable; MP: SHT30-DIS-B; Value: *; SnapEDA_Link: https://www.snapeda.com/parts/SHT30-DIS-B/Sensirion%20AG/view-part/231868/?ref=snap; Price: None
U7 = OPTICAL-TSL2561T(6P-3.8X2.6MM): Optical Sensor Ambient 640nm IÂ²C 6-SMD, No Lead; MF: ams; Price: None; Value: *; MP: TSL2561T; Package: SMD-6 ams; SnapEDA_Link: https://www.snapeda.com/parts/TSL2561T/ams/view-part/225280/?ref=snap; Availability: Unavailable

## Nets that join several sheets
+3V3: 02. ZIGBEE CC2530 (D.1 DS1.1 FB1.1 R5.2), 03. MCU (7 pins), 04. SENSOR SHT30, PIR, TSL2561 (11 pins)
GND: 02. ZIGBEE CC2530 (33 pins), 03. MCU (12 pins), 04. SENSOR SHT30, PIR, TSL2561 (18 pins)
NetR9_1: 03. MCU (U3.18), 04. SENSOR SHT30, PIR, TSL2561 (R9.1 U5.3 U6.1 U7.6)
NetR10_1: 03. MCU (U3.17), 04. SENSOR SHT30, PIR, TSL2561 (R10.1 U5.6 U6.4 U7.4)
NetU1_5: 02. ZIGBEE CC2530 (U1.5), 03. MCU (U3.6)
NetU1_6: 02. ZIGBEE CC2530 (U1.6), 03. MCU (U3.7)
NetU1_37: 02. ZIGBEE CC2530 (U1.37), 03. MCU (U3.8)
NetU1_38: 02. ZIGBEE CC2530 (U1.38), 03. MCU (U3.9)
Z_RST: 02. ZIGBEE CC2530 (RST.1 U1.20), 03. MCU (C22.2 R8.2 SW2.2 U3.4)